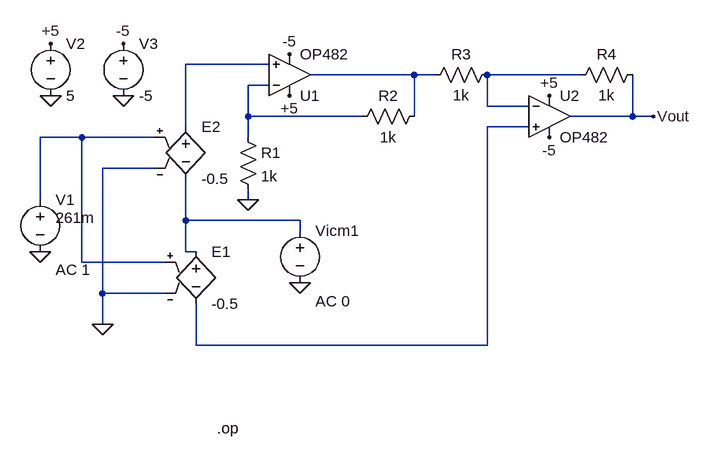
[diagram p0: schematic Draft1.asc]
Draft1.asc, the LTspice schematic file:
Version 4.1
SHEET 1 880 680
WIRE -128 -64 -256 -64
WIRE 96 -48 -64 -48
WIRE 128 -48 96 -48
WIRE 352 -48 208 -48
WIRE -128 -32 -160 -32
WIRE 208 0 208 -48
WIRE 272 0 208 0
WIRE -160 16 -160 -32
WIRE 16 16 -160 16
WIRE 96 16 96 -48
WIRE 432 16 432 -48
WIRE 432 16 336 16
WIRE 464 16 432 16
WIRE -256 32 -256 -64
WIRE 272 32 208 32
WIRE -416 48 -480 48
WIRE -304 48 -416 48
WIRE -160 48 -160 16
WIRE -304 96 -384 96
WIRE -480 144 -480 48
WIRE -160 144 -160 128
WIRE -256 176 -256 112
WIRE -80 176 -256 176
WIRE -80 192 -80 176
WIRE -256 224 -256 176
WIRE -240 224 -256 224
WIRE -416 240 -416 48
WIRE -288 240 -416 240
WIRE -384 288 -384 96
WIRE -288 288 -384 288
WIRE -384 336 -384 288
WIRE -240 368 -240 304
WIRE 208 368 208 32
WIRE 208 368 -240 368
FLAG -160 144 0
FLAG -96 -16 +5
FLAG -96 -80 -5
FLAG 304 48 -5
FLAG 304 -16 +5
FLAG -384 336 0
FLAG -480 224 0
FLAG -80 272 0
FLAG -464 -96 +5
FLAG -352 -96 -5
FLAG -464 -16 0
FLAG -352 -16 0
FLAG 464 16 Vout
DATAFLAG 240 -48 ""
DATAFLAG -256 -16 ""
DATAFLAG -208 368 ""
DATAFLAG 432 -16 ""
DATAFLAG 0 -48 ""
DATAFLAG -192 -64 ""
DATAFLAG -144 176 ""
DATAFLAG -160 32 ""
DATAFLAG -80 16 ""
DATAFLAG -384 48 ""
DATAFLAG -368 96 ""
DATAFLAG -368 240 ""
DATAFLAG 240 32 ""
SYMBOL OpAmps\\OP482 -96 16 M180
SYMATTR InstName U1
SYMBOL OpAmps\\OP482 304 -48 R0
SYMATTR InstName U2
SYMBOL res -176 32 R0
SYMATTR InstName R1
SYMATTR Value 1k
SYMBOL res 112 0 R90
WINDOW 0 0 56 VBottom 2
WINDOW 3 32 56 VTop 2
SYMATTR InstName R2
SYMATTR Value 1k
SYMBOL res 224 -64 R90
WINDOW 0 0 56 VBottom 2
WINDOW 3 32 56 VTop 2
SYMATTR InstName R3
SYMATTR Value 1k
SYMBOL res 448 -64 R90
WINDOW 0 0 56 VBottom 2
WINDOW 3 32 56 VTop 2
SYMATTR InstName R4
SYMATTR Value 1k
SYMBOL e -240 208 R0
SYMATTR InstName E1
SYMATTR Value -0.5
SYMBOL e -256 16 R0
SYMATTR InstName E2
SYMATTR Value -0.5
SYMBOL voltage -480 128 R0
WINDOW 123 24 124 Left 2
WINDOW 39 0 0 Left 0
WINDOW 3 24 44 Left 2
SYMATTR Value2 AC 1
SYMATTR Value 261m
SYMATTR InstName V1
SYMBOL voltage -80 176 R0
WINDOW 123 24 124 Left 2
WINDOW 39 0 0 Left 0
SYMATTR Value2 AC 0
SYMATTR InstName Vicm1
SYMATTR Value ""
SYMBOL voltage -464 -112 R0
SYMATTR InstName V2
SYMATTR Value 5
SYMBOL voltage -352 -112 R0
SYMATTR InstName V3
SYMATTR Value -5
TEXT -208 496 Left 2 !.op

The netlist it stands for:
* Draft1.asc
X§U1 N001 N004 +5 -5 N002 OP482  ; pins In+ In- V+ V- OUT
X§U2 N005 N003 +5 -5 Vout OP482  ; pins In+ In- V+ V- OUT
R1 N004 0 1k
R2 N002 N004 1k
R3 N003 N002 1k
R4 Vout N003 1k
E1 N007 N005 N006 0 -0.5
E2 N001 N007 N006 0 -0.5
V1 N006 0 261m AC 1
Vicm1 N007 0 AC 0
V2 +5 0 5
V3 -5 0 -5
.op
.backanno
.end